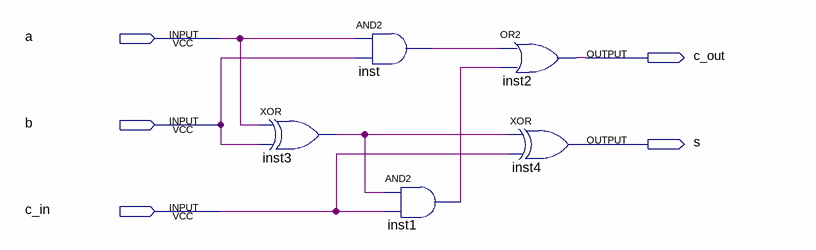
[diagram p0: schematic sheet]
// Quartus schematic Adder_1.bdf as structural Verilog: 5 symbols, 5 pins
module Adder_1 (
  input  a,
  input  b,
  input  c_in,
  output c_out,
  output s
);

  wire inst1_out, inst3_out, inst_out;

  xor inst3 (inst3_out, a, b);
  and inst (inst_out, a, b);
  and inst1 (inst1_out, inst3_out, c_in);
  or inst2 (c_out, inst_out, inst1_out);
  xor inst4 (s, inst3_out, c_in);
endmodule
